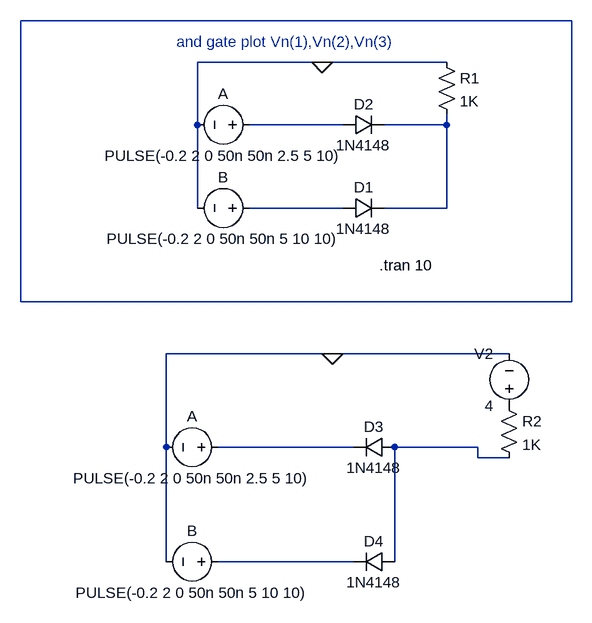
[diagram p0: schematic diode_as_logic.asc]
diode_as_logic.asc, the LTspice schematic file:
Version 4
SHEET 1 880 848
WIRE 528 -48 -320 -48
WIRE 144 16 -48 16
WIRE 336 16 144 16
WIRE -48 112 -48 16
WIRE 176 112 32 112
WIRE 336 112 336 96
WIRE 336 112 240 112
WIRE -48 240 -48 112
WIRE 176 240 32 240
WIRE 336 240 336 112
WIRE 336 240 240 240
WIRE -320 384 -320 -48
WIRE 528 384 528 -48
WIRE 528 384 -320 384
WIRE 160 464 -96 464
WIRE 432 464 160 464
WIRE -96 608 -96 464
WIRE 192 608 -16 608
WIRE 384 608 256 608
WIRE 384 624 384 608
WIRE 432 624 384 624
WIRE -96 784 -96 608
WIRE 192 784 -16 784
WIRE 256 784 256 608
FLAG 144 16 0
FLAG 160 464 0
SYMBOL diode 176 256 R270
WINDOW 0 32 32 VTop 2
WINDOW 3 0 32 VBottom 2
SYMATTR InstName D1
SYMATTR Value 1N4148
SYMBOL diode 176 128 R270
WINDOW 0 32 32 VTop 2
WINDOW 3 0 32 VBottom 2
SYMATTR InstName D2
SYMATTR Value 1N4148
SYMBOL res 320 0 R0
SYMATTR InstName R1
SYMATTR Value 1K
SYMBOL voltage 48 240 R90
WINDOW 0 -32 56 VBottom 2
WINDOW 3 32 56 VTop 2
SYMATTR InstName B
SYMATTR Value PULSE(-0.2 2 0 50n 50n 5 10 10)
SYMBOL voltage 48 112 R90
WINDOW 0 -32 56 VBottom 2
WINDOW 3 32 56 VTop 2
WINDOW 123 0 0 Left 0
WINDOW 39 0 0 Left 0
SYMATTR InstName A
SYMATTR Value PULSE(-0.2 2 0 50n 50n 2.5 5 10)
SYMBOL diode 256 592 R90
WINDOW 0 0 32 VBottom 2
WINDOW 3 32 32 VTop 2
SYMATTR InstName D3
SYMATTR Value 1N4148
SYMBOL diode 256 768 R90
WINDOW 0 0 32 VBottom 2
WINDOW 3 32 32 VTop 2
SYMATTR InstName D4
SYMATTR Value 1N4148
SYMBOL voltage 0 608 R90
WINDOW 0 -32 56 VBottom 2
WINDOW 3 32 56 VTop 2
SYMATTR InstName A
SYMATTR Value PULSE(-0.2 2 0 50n 50n 2.5 5 10)
SYMBOL voltage 0 784 R90
WINDOW 0 -32 56 VBottom 2
WINDOW 3 32 56 VTop 2
SYMATTR InstName B
SYMATTR Value PULSE(-0.2 2 0 50n 50n 5 10 10)
SYMBOL res 416 528 R0
SYMATTR InstName R2
SYMATTR Value 1K
SYMBOL voltage 432 560 R180
WINDOW 0 24 96 Left 2
WINDOW 3 24 16 Left 2
SYMATTR InstName V2
SYMATTR Value 4
TEXT 232 328 Left 2 !.tran 10
TEXT -80 -16 Left 2 ;and gate plot Vn(1),Vn(2),Vn(3)

The netlist it stands for:
* diode_as_logic.asc
D1 N004 N003 1N4148
D2 N002 N003 1N4148
R1 0 N003 1K
V§B N004 0 PULSE(-0.2 2 0 50n 50n 5 10 10)
V§A N002 0 PULSE(-0.2 2 0 50n 50n 2.5 5 10)
D3 N006 N005 1N4148
D4 N006 N007 1N4148
V§A N005 0 PULSE(-0.2 2 0 50n 50n 2.5 5 10)
V§B N007 0 PULSE(-0.2 2 0 50n 50n 5 10 10)
R2 P001 N006 1K
V2 P001 0 4
.model D D
.lib standard.dio
.tran 10
* and gate plot Vn(1),Vn(2),Vn(3)
.backanno
.end